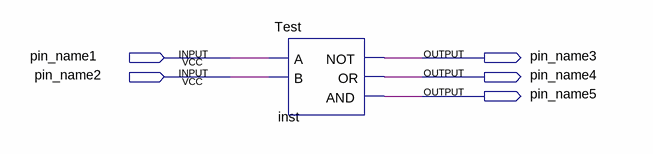
[diagram p0: schematic sheet]
// Quartus schematic Block2.bdf as structural Verilog: 1 symbols, 5 pins
module Block2 (
  input  pin_name1,
  input  pin_name2,
  output pin_name3,
  output pin_name4,
  output pin_name5
);

  Test inst (.A(pin_name1), .B(pin_name2), .NOT(pin_name3), .OR(pin_name4), .AND(pin_name5));
endmodule
